# EasyEDA Pro project ProPrj_ESP32 Touchpad.epro, board PCB1
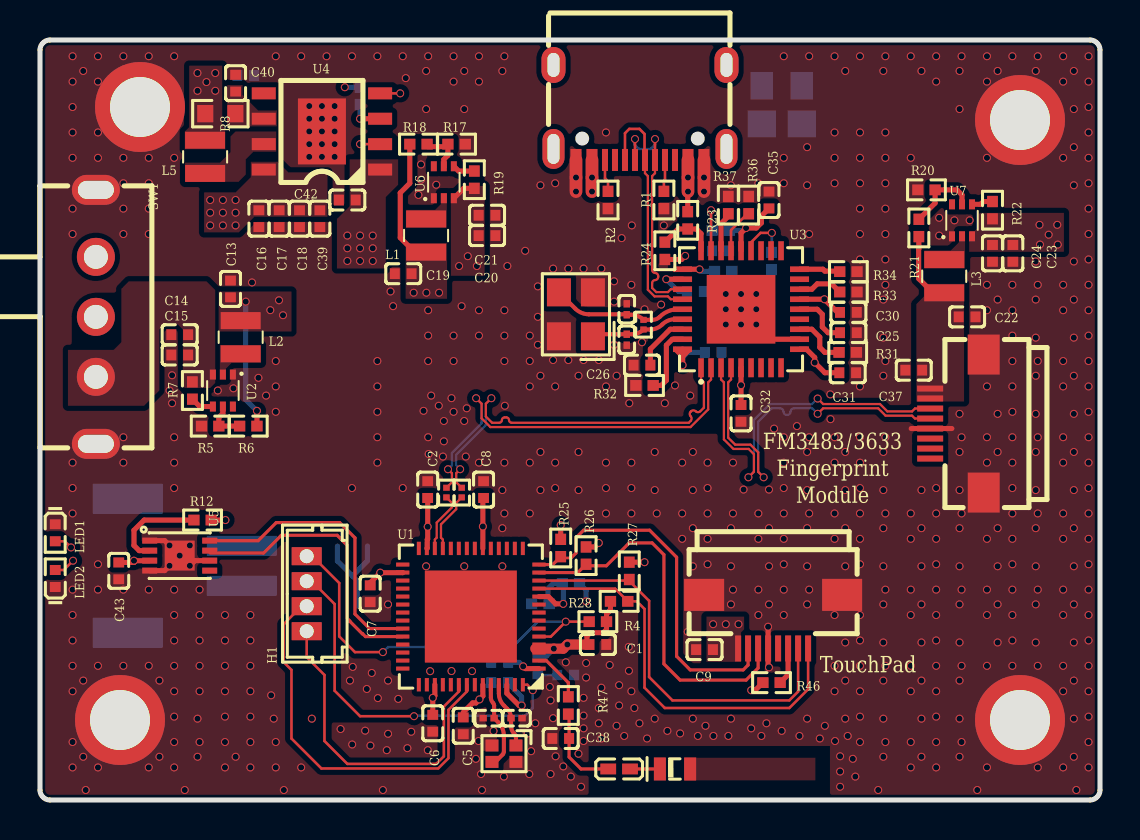
[diagram p5: board, top side]
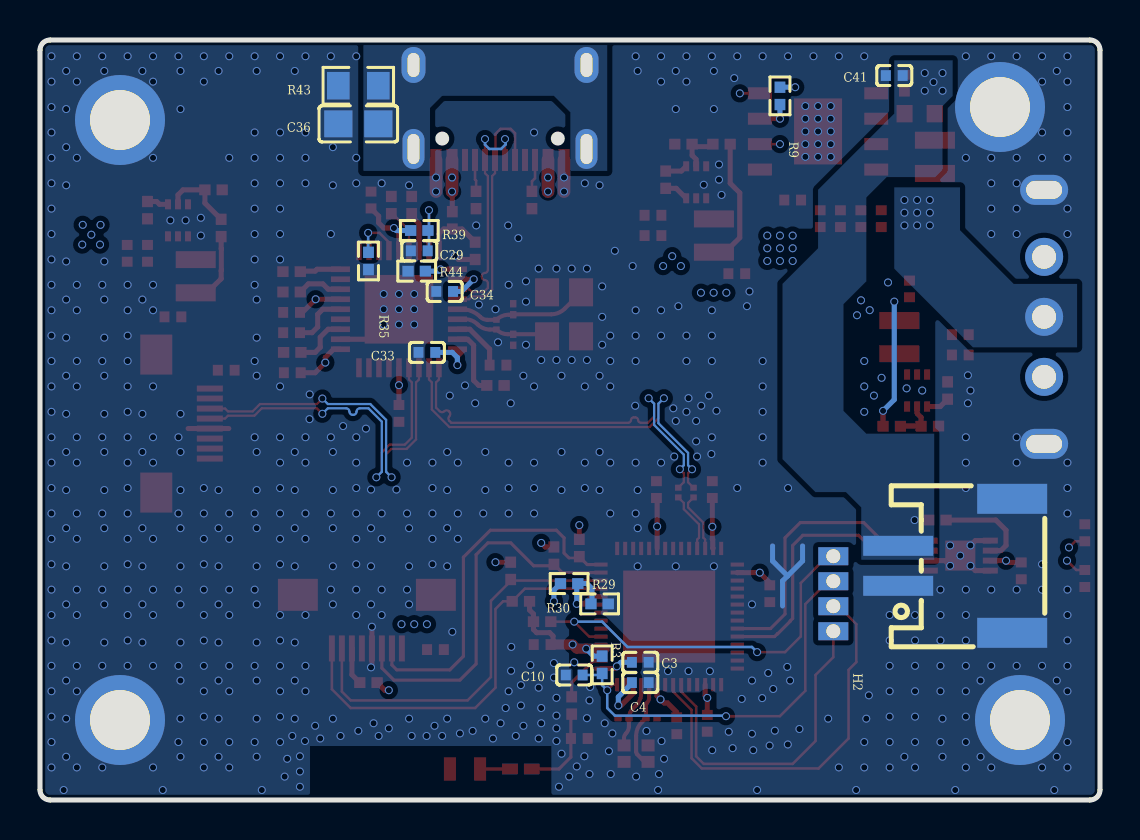
[diagram p6: board, bottom side, seen from below]

Outline 53 x 38 mm; copper layers: Top Layer, Inner1, Inner2, Bottom Layer. Coordinates in mm from the lower left corner of the outline.
Outline path: 0,37.5 0,0.5 arc(0.15,0.15) 0.5,0 52.5,0 arc(52.85,0.15) 53,0.5 53,37.5 arc(52.85,37.85) 52.5,38 0.5,38 arc(0.15,37.85) 0,37.5
Stack: Top Layer 0.035mm Outer layer thickness 1oz / Dielectric1 0.28mm 7628 RC49% 8.6mil / Inner1 0.035mm Inner layer thickness / Dielectric2 0.28mm 1.1mm H/HOZ Copper / Inner2 0.035mm Inner layer thickness / Dielectric3 0.28mm 7628 RC49% 8.6mil / Bottom Layer 0.035mm Outer layer thickness 1oz

## Design rules (mm)
net D-: D
net D+: D
net D1-: D1
net D1+: D1
net D2-: D2
net D2+: D2
net ESP_D_R-: ESP_D_R
net ESP_D_R+: ESP_D_R
spacing copperThickness1oz (default): track to track 0.102, other pairs 0.152 to 0.3
spacing copperThickness2oz: track to track 0.203, other pairs 0.152 to 0.3
track width copperThickness1oz (default): min 0.127, default 0.254, max 2.54
track width copperThickness2oz: min 0.203, default 0.254, max 2.54
differential pair differentialPair (default): width min 0.112, default 0.112, max 2.54; gap min 0.102, default 0.102
net GND uses copperRegion

## Placement (name value [footprint] x y rotation side)
ANT1  KH-1608-H08  [ANT-SMD_L1.7-W0.9]  31.75 1.55 180 top
C1  100nF  [C0402]  27.89 7.77 0 top
C2  100nF  [C0402]  19.38 15.52 90 top
C3  100nF  [C0402]  22.99 6.89 180 bottom
C4  100nF  [C0402]  22.99 5.87 180 bottom
C5  100nF  [C0402]  21.16 3.71 270 top
C6  100nF  [C0402]  19.64 3.84 270 top
C7  100nF  [C0402]  16.51 10.31 270 top
C8  100nF  [C0402]  22.18 15.52 90 top
C9  1uF  [C0402]  33.23 7.52 0 top
C10  1uF  [C0402]  26.29 6.25 180 bottom
C11  12pF  [C0201]  23.83 4.09 0 top
C12  12pF  [C0201]  22.43 4.09 180 top
C13  22uF  [C0402]  9.53 25.55 270 top
C14  100nF  [C0402]  6.98 23.27 0 top
C15  10uF  [C0402]  6.98 22.25 0 top
C16  22uF  [C0402]  10.94 29.07 90 top
C17  22uF  [C0402]  11.96 29.07 90 top
C18  22uF  [C0402]  12.98 29.07 90 top
C19  22uF  [C0402]  18.16 26.32 0 top
C20  100nF  [C0402]  22.35 28.22 180 top
C21  10uF  [C0402]  22.35 29.24 180 top
C22  22uF  [C0402]  46.35 24.16 180 top
C23  100nF  [C0402]  48.64 27.33 90 top
C24  10uF  [C0402]  47.62 27.33 90 top
C25  100nF  [C0402]  40.42 23.37 0 top
C26  100nF  [C0402]  30.1 21.74 0 top
C27  12pF  [C0201]  29.34 23.01 270 top
C28  12pF  [C0201]  29.34 24.54 90 top
C29  100nF  [C0402]  34.04 27.46 180 bottom
C30  100nF  [C0402]  40.42 24.38 0 top
C31  100nF  [C0402]  40.39 21.36 0 top
C32  100nF  [C0402]  35.05 19.33 270 top
C33  100nF  [C0402]  33.66 22.38 0 bottom
C34  100nF  [C0402]  32.77 25.43 0 bottom
C35  100nF  [C0402]  36.45 30 90 top
C36  100nF  [C0805]  37.08 33.81 0 bottom
C37  1uF  [C0402]  43.69 21.49 0 top
C38  1.5pF  [C0402]  26.03 3.08 0 top
C39  22uF  [C0402]  13.99 29.07 90 top
C40  22uF  [C0402]  9.78 35.84 270 top
C41  22uF  [C0402]  10.29 36.22 180 bottom
C42  22uF  [C0402]  15.37 30 180 top
C43  100nF  [C0402]  3.94 11.46 270 top
FPC1  AFC01-S08FCA-00  [FPC-SMD_P0.50-8P_FGS-XJ-H2.0]  36.66 8.92 0 top
FPC2  AFC01-S08FCA-00  [FPC-SMD_P0.50-8P_FGS-XJ-H2.0]  45.85 18.82 270 top
H1  WAFER-MX1.25-4PZZ  [CONN-TH_4P-P1.25_WAFER-MX1.25-4PZZ]  13.34 10.31 90 top
H2  WAFER-PH2.0-2PWB  [CONN-SMD_2P-P2.00_XUNPU_WAFER-PH2.0-2PWB]  7.24 11.71 90 bottom
L1  4.7uH  [IND-SMD_L2.5-W2.0-VLS252012CX-150M]  19.3 28.22 270 top
L2  4.7uH  [IND-SMD_L2.5-W2.0-VLS252012CX-150M]  10.03 23.14 90 top
L3  4.7uH  [IND-SMD_L2.5-W2.0-VLS252012CX-150M]  45.21 26.19 270 top
L4  10nH  [L0402-RD]  28.96 1.55 180 top
L5  1uH  [IND-SMD_L2.5-W2.0-VLS252012CX-150M]  8.25 32.16 90 top
LED1  NCD0402R1  [LED0402-RD]  0.76 13.36 270 top
LED2  NCD0402R1  [LED0402-RD]  0.76 11.08 90 top
NOREF  -  [Pad_e344]  49 34 0 top
NOREF#2  -  [Pad_e342]  5 34.65 0 top
NOREF#3  -  [Pad_e343]  49 4 0 top
NOREF#4  -  [Pad_e341]  4 4 0 top
R1  5.1kΩ  [R0402]  31.19 30 90 top
R2  5.1kΩ  [R0402]  28.4 30 90 top
R3  10kΩ  [R0402]  24.89 6.76 90 bottom
R4  10kΩ  [R0402]  27.89 8.92 0 top
R5  110kΩ  [R0402]  8.51 18.69 0 top
R6  510kΩ  [R0402]  10.41 18.69 0 top
R7  5.1kΩ  [R0402]  7.62 20.47 270 top
R8  500mΩ  [R0603]  9.02 34.32 180 top
R9  5.1kΩ  [R0402]  16 35.21 90 bottom
R10  22Ω  [R0201]  21.08 15.37 270 top
R11  22Ω  [R0201]  20.32 15.37 270 top
R12  470Ω  [R0402]  8.13 14 180 top
R17  110kΩ  [R0402]  20.83 32.79 180 top
R18  510kΩ  [R0402]  18.92 32.79 180 top
R19  5.1kΩ  [R0402]  21.72 31.02 90 top
R20  110kΩ  [R0402]  44.32 30.51 0 top
R21  510kΩ  [R0402]  43.94 28.6 270 top
R22  5.1kΩ  [R0402]  47.62 29.49 90 top
R23  47kΩ  [R0402_1]  32.38 28.98 90 top
R24  100kΩ  [R0402_1]  31.24 27.46 90 top
R25  5.1kΩ  [R0402]  26.03 12.6 270 top
R26  5.1kΩ  [R0402]  27.31 12.22 270 top
R27  5.1kΩ  [R0402]  29.46 11.46 270 top
R28  5.1kΩ  [R0402]  28.96 9.93 0 top
R29  47kΩ  [R0402_1]  26.54 10.82 0 bottom
R30  100kΩ  [R0402_1]  25.02 9.81 0 bottom
R31  5.1kΩ  [R0402]  40.39 22.38 0 top
R32  12kΩ  [R0402]  30.23 20.73 180 top
R33  5.1kΩ  [R0402]  40.42 25.4 0 top
R34  5.1kΩ  [R0402]  40.42 26.42 0 top
R35  5.1kΩ  [R0402]  36.58 26.95 270 bottom
R36  5.1kΩ  [R0402]  35.43 29.75 90 top
R37  5.1kΩ  [R0402]  34.42 29.75 90 top
R39  100kΩ  [R0402_1]  34.04 28.47 0 bottom
R40  1MΩ  [R0201]  30.18 23.77 90 top
R43  1MΩ  [R0805]  37.08 35.71 0 bottom
R44  5.1kΩ  [R0402]  34.16 26.44 0 bottom
R46  10kΩ  [R0402]  36.58 5.87 180 top
R47  0Ω  [R0402_1]  26.42 4.73 90 top
SW1  SK12F14G5  [SW-TH_SK12F14G5]  2.79 24.16 270 top
U1  2.4GHz  [QFN-56_L7.0-W7.0-P0.40-TL-EP4.6]  21.54 9.17 180 top
U2  TPS62A02DRLR  [SOT-563_L1.6-W1.2-P0.50-LS1.6-TL]  9.14 20.47 270 top
U3  USB2513B/M2  [QFN-36_L6.0-W6.0-P0.50-BL-EP3.9]  35.05 24.54 0 top
U4  IP5306  [ESOP-8_L4.9-W3.9-P1.27-LS6.0-BL-EP]  14.1 33.43 90 top
U5  CW2015CHBD  [TDFN-8_L3.0-W2.0-P0.50-BL-EP]  6.98 12.22 270 top
U6  TPS62A02DRLR  [SOT-563_L1.6-W1.2-P0.50-LS1.6-TL]  20.19 30.89 90 top
U7  TPS62A02DRLR  [SOT-563_L1.6-W1.2-P0.50-LS1.6-TL]  46.1 28.98 90 top
USB1  TYPE-C 16PIN 2MD(073)  [USB-C-SMD_TYPE-C-6PIN-2MD-073]  30 34.38 180 top
X1  40MHz  [CRYSTAL-SMD_4P-L1.6-W1.2-BL]  23.2 2.32 180 top
X2  24MHz  [CRYSTAL-SMD_4P-L3.2-W2.5-BL]  26.8 24.28 90 top

## Footprints (pads in the part's own frame, mm; a bottom-side part is the same pattern mirrored in y, then rotated)
ANT-SMD_L1.7-W0.9
  rect 0.6x1.15 smd: 1(-0.756,0) 2(0.756,0)
C0201
  rect 0.368x0.324 smd: 1(-0.275,0) 2(0.275,0)
C0402
  rect 0.5x0.54 smd: 1(-0.42,0) 2(0.42,0)
C0805
  rect 1.41x1.35 smd: 1(-1,0) 2(1,0)
CONN-SMD_2P-P2.00_XUNPU_WAFER-PH2.0-2PWB
  rect 1x3.5 smd: 1(-1,2.85) 2(1,2.85)
  rect 1.5x3.5 smd: 3(-3.35,-2.85) 4(3.35,-2.85)
CONN-TH_4P-P1.25_WAFER-MX1.25-4PZZ
  rect 0.9x1.5 hole 0.7: 1(1.875,0) 2(0.625,0) 3(-0.625,0) 4(-1.875,0)
CRYSTAL-SMD_4P-L1.6-W1.2-BL
  rect 0.65x0.6 smd: 1(-0.6,-0.41) 2(0.6,-0.41) 3(0.6,0.41) 4(-0.6,0.41)
CRYSTAL-SMD_4P-L3.2-W2.5-BL
  rect 1.4x1.2 smd: 1(-1.1,-0.85) 2(1.1,-0.85) 3(1.1,0.85) 4(-1.1,0.85)
ESOP-8_L4.9-W3.9-P1.27-LS6.0-BL-EP
  rect 0.6x1.2 smd: 1(-1.905,-2.909) 2(-0.635,-2.909) 3(0.635,-2.909) 4(1.905,-2.909) 5(1.905,2.909) 6(0.635,2.909) 7(-0.635,2.909) 8(-1.905,2.909)
  rect 3.3x2.4 smd: 9(0,0)
FPC-SMD_P0.50-8P_FGS-XJ-H2.0
  rect 0.3x1.3 smd: 1(-1.75,-1.34) 2(-1.252,-1.339) 3(-0.75,-1.34) 4(-0.25,-1.34) 5(0.25,-1.34) 6(0.75,-1.34) 7(1.25,-1.34) 8(1.75,-1.34)
  rect 2x1.6 smd: 9(3.45,1.34) 10(-3.45,1.34)
IND-SMD_L2.5-W2.0-VLS252012CX-150M
  rect 0.85x2 smd: 1(-0.83,0) 2(0.83,0)
L0402-RD
  rect 0.79x0.54 smd: 1(-0.545,0) 2(0.545,0)
LED0402-RD
  rect 0.5x0.54 smd: 1(-0.425,0) 2(0.425,0)
Pad_e341
  round 4.5 hole 3: 1(0,0)
Pad_e342
  round 4.5 hole 3: 1(0,0)
Pad_e343
  round 4.5 hole 3: 1(0,0)
Pad_e344
  round 4.5 hole 3: 1(0,0)
QFN-36_L6.0-W6.0-P0.50-BL-EP3.9
  rect 0.28x0.95 smd: 1(-2,-2.925) 2(-1.5,-2.925) 3(-1,-2.925) 4(-0.5,-2.925) 5(0,-2.925) 6(0.5,-2.925) 7(1,-2.925) 8(1.5,-2.925) 9(2,-2.925) 19(2,2.925) 20(1.5,2.925) 21(1,2.925) 22(0.5,2.925) 23(0,2.925) 24(-0.5,2.925) 25(-1,2.925) 26(-1.5,2.925) 27(-2,2.925)
  rect 0.95x0.28 smd: 10(2.925,-2) 11(2.925,-1.5) 12(2.925,-1) 13(2.925,-0.5) 14(2.925,0) 15(2.925,0.5) 16(2.925,1) 17(2.925,1.5) 18(2.925,2) 28(-2.925,2) 29(-2.925,1.5) 30(-2.925,1) 31(-2.925,0.5) 32(-2.925,0) 33(-2.925,-0.5) 34(-2.925,-1) 35(-2.925,-1.5) 36(-2.925,-2)
  rect 3.429x3.429 smd: 37(0,0)
QFN-56_L7.0-W7.0-P0.40-TL-EP4.6
  rect 0.665x0.2 smd: 1(-3.408,2.6) 2(-3.408,2.2) 3(-3.408,1.8) 4(-3.408,1.4) 5(-3.408,1) 6(-3.408,0.6) 7(-3.408,0.2) 8(-3.408,-0.2) 9(-3.408,-0.6) 10(-3.408,-1) 11(-3.408,-1.4) 12(-3.408,-1.8) 13(-3.408,-2.2) 14(-3.408,-2.6) 29(3.408,-2.6) 30(3.408,-2.2) 31(3.408,-1.8) 32(3.408,-1.4) 33(3.408,-1) 34(3.408,-0.6) 35(3.408,-0.2) 36(3.408,0.2) 37(3.408,0.6) 38(3.408,1) 39(3.408,1.4) 40(3.408,1.8) 41(3.408,2.2) 42(3.408,2.6)
  rect 0.2x0.665 smd: 15(-2.6,-3.408) 16(-2.2,-3.408) 17(-1.8,-3.408) 18(-1.4,-3.408) 19(-1,-3.408) 20(-0.6,-3.408) 21(-0.2,-3.408) 22(0.2,-3.408) 23(0.6,-3.408) 24(1,-3.408) 25(1.4,-3.408) 26(1.8,-3.408) 27(2.2,-3.408) 28(2.6,-3.408) 43(2.6,3.408) 44(2.2,3.408) 45(1.8,3.408) 46(1.4,3.408) 47(1,3.408) 48(0.6,3.408) 49(0.2,3.408) 50(-0.2,3.408) 51(-0.6,3.408) 52(-1,3.408) 53(-1.4,3.408) 54(-1.8,3.408) 55(-2.2,3.408) 56(-2.6,3.408)
  rect 4.6x4.6 smd: 57(0,0)
R0201
  rect 0.303x0.324 smd: 1(-0.241,0) 2(0.241,0)
R0402
  rect 0.566x0.54 smd: 1(-0.433,0) 2(0.433,0)
R0402_1
  rect 0.566x0.54 smd: 1(-0.433,0) 2(0.433,0)
R0603
  rect 0.806x0.864 smd: 1(-0.753,0) 2(0.753,0)
R0805
  rect 1.133x1.377 smd: 1(-1,0) 2(1,0)
SOT-563_L1.6-W1.2-P0.50-LS1.6-TL
  rect 0.5x0.3 smd: 1(-0.8,0.5) 2(-0.8,0) 3(-0.8,-0.5) 4(0.8,-0.5) 5(0.8,0) 6(0.8,0.5)
SW-TH_SK12F14G5
  round 1.9 hole 1.2: 1(-3,0) 2(0,0) 3(3,0)
  oval 1.5x2.4 hole 0.9x1.8: 4(6.35,0) 5(-6.35,0)
TDFN-8_L3.0-W2.0-P0.50-BL-EP
  rect 0.3x0.75 smd: 1(-0.75,-1.5) 2(-0.249,-1.5) 3(0.25,-1.5) 4(0.75,-1.5) 5(0.75,1.5) 6(0.25,1.5) 7(-0.249,1.5) 8(-0.75,1.5)
  rect 1.5x1.5 smd: 9(-0.001,-0.001)
USB-C-SMD_TYPE-C-6PIN-2MD-073
  rect 0.55x1.1 smd: 1(-3.2,2.375) 2(-2.4,2.375) 11(2.4,2.375) 12(3.2,2.375)
  rect 0.3x1.1 smd: 3(-1.75,2.375) 4(-1.25,2.375) 5(-0.75,2.375) 6(-0.25,2.375) 7(0.25,2.375) 8(0.75,2.375) 9(1.25,2.375) 10(1.75,2.375)
  oval 1.1x2 hole 0.6x1.5: 13(-4.325,1.825) 14(4.325,1.825)
  oval 1.2x1.8 hole 0.6x1.2: 13(-4.325,-2.375) 14(4.325,-2.375)

## Nets
As in the schematic, except:
+3.3V_2513B: C19.1 L1.2 R18.2 R39.2 U3.5 U3.10 U3.15 U3.23 U3.29 U3.36
+3.3V_ESP32: C3.1 C4.1 C7.1 C9.1 C13.2 C43.1 FPC1.1 L2.2 R3.2 R4.2 R6.2 R25.1 R26.1 R27.1 R28.1 R46.2 U1.1 U1.3 U1.4 U1.20 U1.27 U1.30 U1.45 U1.51 U1.54 U5.3
+3.3V_FIG: C22.1 C37.1 FPC2.1 FPC2.2 L3.2 R21.2
+5V: C20.1 C21.1 C23.1 C24.1 C42.1 R19.1 R22.1 R23.2 R29.2 U4.1 U6.3 U7.3 USB1.2 USB1.11
GND: C1.1 C2.1 C3.2 C4.2 C5.1 C6.1 C7.2 C8.1 C10.1 C11.2 C12.2 C13.1 C14.1 C15.1 C16.1 C17.1 C18.1 C25.1 C27.2 C28.2 C30.1 C31.1 C32.1 C33.1 C34.1 C35.1 C36.2 C38.1 C39.1 C40.1 C41.1 C42.2 C43.2 FPC1.4 FPC1.9 FPC1.10 FPC2.5 FPC2.9 FPC2.10 H2.1 H2.3 H2.4 LED1.1 LED2.1 NOREF.1 NOREF#2.1 NOREF#3.1 NOREF#4.1 R1.1 R2.1 R5.1 R17.1 R20.1 R24.1 R30.1 R31.2 R32.2 R33.2 R34.2 R35.2 R36.2 R37.2 R43.2 R44.2 SW1.4 SW1.5 U1.57 U2.1 U3.11 U3.37 U4.9 U5.1 U5.4 U5.6 U5.9 U6.1 U7.1 USB1.1 USB1.12 X1.2 X1.4 X2.2 X2.4
2513B_RST#: C29.1 R39.1 U3.26
$4N122: C26.1 U3.34

Pads without a net: ANT1 1; C1 2; C2 2; C5 2; C6 2; C8 2; C9 2; C19 2; C20 2; C21 2; C22 2; C23 2; C24 2; C25 2; C26 2; C29 2; C30 2; C31 2; C32 2; C33 2; C34 2; C35 2; C37 2; FPC1 5; FPC2 6 7 8; SW1 1; U1 6 7 8 9 15 16 17 18 19 21 22 23 24 28 29 31 32 33 34 35 36 39 40 41 42 43 44 46 47 50 55; U2 6; U3 6 7 8 9 13 17 19 20 21; U4 5; U5 5; U6 6; U7 6; USB1 3 9

## Via types
v1: diameter 0.399, hole 0.305, Top Layer to Bottom Layer, 738 vias

## Routing (per net, layer and track width the routed paths; a pad name or vN(x,y) marks a point on that pad's centre or on a via; arc(x,y) is an arc through that point)
+3.3V_2513B: length 60.2
  Top Layer w0.254: U3.15 v1(39.22,25.04) 39.88,24.38 ; 36.45,29.58 36.07,29.2 36.07,28.86 35.81,28.6 v1(35.3,28.6) 35.05,28.35 U3.23 ; U3.5 v1(35.05,20.74) 35.05,19.88 ; R18.2 18.49,30.84 18.01,30.36 18.01,28.12 18.74,27.39 L1.2 ; 32.13,22.54 32.13,22.53 32.13,22.18 ; U3.10 38.32,22.54 38.74,22.12 v1(38.74,21.87) 39.24,21.36 39.84,21.36 ; 32.44,22.52 32.44,22.49 32.13,22.18 ; 32.13,22.18 31.78,22.53 ; 32.13,22.18 v1(32.13,21.74) ; 32.13,26.04 v1(31.31,26.04)
  Inner2 w0.762: 35.32,28.6 35.81,29.09 39.26,29.09 39.98,28.37 39.98,25.8 v1(39.22,25.04) 38.74,24.56 v1(38.74,21.87) 37.6,20.74 v1(35.05,20.74) 33.13,20.74 v1(32.13,21.74) 32,21.87 32,25.35 v1(31.31,26.04) 30.05,27.3 25.35,27.3 23.6,25.55 20.14,25.55 v1(19.95,25.36) v1(19.32,25.36) v1(18.68,25.36)
  Bottom Layer w0.254: v1(32.13,21.74) 32.13,22.12 32.38,22.38 33.11,22.38 ; R39.2 35.18,28.47 v1(35.3,28.6) ; v1(31.31,26.04) 31.93,25.43 32.22,25.43
+3.3V_ESP32: length 130.5
  Top Layer w0.254: 22.18,14.98 22.14,14.94 v1(22.14,13.68) U1.20 ; U5.3 5.48,11.97 v1(4.7,11.97) 4.7,11.88 C43.1 ; U1.45 19.74,5.21 v1(19.64,5.11) 19.64,4.38 ; U1.1 24.27,6.57 v1(24.16,6.68) ; R46.2 35.76,5.49 v1(35.56,5.49) ; 10.85,18.69 v1(10.85,19.46) ; v1(27.94,12.85) 27.74,12.65 R26.1 ; U1.51 22.14,5.2 v1(21.97,5.03) 21.8,4.85 21.63,4.85 21.16,4.38 ; R27.1 v1(30.23,11.89) ; U1.27 19.36,12.6 19.36,13.03 19.38,13.05 v1(19.38,13.66) 19.38,14.98 ; U1.54 23.34,5.34 23.95,4.73 v1(24.08,4.73) ; U1.30 18.13,11.37 v1(17.01,11.37) 16.51,10.87 C7.1 ; R28.1 28.52,9.5 28.33,9.3 R4.2 28.33,8.53 28.17,8.37 27.52,8.37 27.35,8.2 27.35,7.77 ; R25.1 v1(26.03,13.74)
  Top Layer w0.508: 24.76,7.57 v1(25.69,7.57) 26.16,7.57 v1(26.37,7.77) 27.35,7.77
  Inner2 w0.254: v1(34.93,8.79) 35.56,8.79 35.94,8.41 35.94,5.87 v1(35.56,5.49)
  Inner2 w0.762: v1(21.97,5.03) 22.28,4.73 ; v1(21.97,5.03) 22.58,5.03 ; v1(21.97,5.03) 19.72,5.03 v1(19.64,5.11) 18.54,6.2 18.54,9.68 17.01,11.21 v1(17.01,11.37) 17.01,12.82 ; 22.28,4.73 22.58,5.03 ; 22.28,4.73 23.21,4.73 ; 17.01,14.53 17.01,15.61 18.44,17.04 18.44,21.84 17.4,22.89 13.5,22.89 v1(12.15,24.24) 11.95,24.44 ; 17.01,14.53 17.87,13.68 ; 17.01,14.53 17.01,13.72 ; 17.01,14.53 16.2,13.72 ; 11.95,24.44 11.9,24.49 v1(11.51,24.49) 11.95,24.93 ; 11.95,24.44 11.95,24.93 ; 22.58,5.03 23.2,5.65 ; 30.23,10.77 31.35,10.77 ; 30.23,10.77 27.47,8.01 ; 30.23,10.77 v1(30.23,11.89) 30.79,11.33 ; 30.23,10.77 30.79,11.33 ; 31.35,10.77 33.33,8.79 v1(33.66,8.79) v1(34.29,8.79) v1(34.93,8.79) ; 31.35,10.77 30.79,11.33 ; v1(25.69,7.57) 25.25,8.01 ; 25.25,8.01 26.13,8.01 ; 25.25,8.01 25.25,8.05 24.89,8.41 ; 23.49,5.94 23.49,5.32 v1(24.08,4.73) ; 23.49,5.94 23.2,5.65 ; 23.49,5.94 24.16,6.61 v1(24.16,6.68) ; 23.2,5.65 23.2,4.74 23.21,4.73 ; 27.47,8.01 27.23,7.77 v1(26.37,7.77) ; 27.47,8.01 26.13,8.01 ; 24.89,7.47 24.89,6.69 24.9,6.68 ; 24.89,7.47 24.89,8.41 ; 24.89,7.47 24.16,6.74 v1(24.16,6.68) ; 17.87,13.68 17.01,12.82 ; 17.87,13.68 17.06,13.68 17.01,13.72 ; 17.87,13.68 v1(22.14,13.68) ; 17.01,12.82 17.01,12.91 ; v1(24.16,6.68) 24.9,6.68 ; v1(27.94,12.85) 27.05,13.74 v1(26.03,13.74) 25.53,13.74 24.89,13.11 24.89,8.41 ; v1(26.37,7.77) 25.99,7.77 24.9,6.68 ; v1(26.37,7.77) 26.13,8.01 ; 11.95,24.93 v1(11.95,24.99) ; 23.21,4.73 23.98,4.73 ; 16.2,13.72 11.83,13.72 10.79,14.76 6.42,14.76 4.7,13.04 v1(4.7,11.97) ; 16.2,13.72 17.01,12.91 ; 16.2,13.72 17.01,13.72 ; 17.01,12.91 17.01,13.72
  Bottom Layer w0.254: 23.41,5.87 23.41,5.83 24.08,5.15 v1(24.08,4.73) ; v1(10.29,24.92) 10.29,20.02 v1(10.85,19.46) ; R3.2 25.31,7.19 v1(25.69,7.57) ; 23.41,6.89 23.96,6.89 v1(24.16,6.68)
+3.3V_FIG: length 3.7
  Top Layer w0.254: R21.2 43.94,27.57 43.93,27.56 43.93,26.48 43.94,26.47 43.94,26.06 44.65,25.36 L3.2
+5V: length 33.4
  Top Layer w0.254: R19.1 21.19,30.58 U6.3 ; R23.2 32.38,30.41 v1(32.4,30.42)
  Top Layer w0.635: v1(27.6,30.42) v1(27.6,31.13) USB1.11 ; USB1.2 v1(32.4,31.13) v1(32.4,30.42)
  Inner2 w0.254: 16.64,26.06 16.64,24.51 18.64,22.51 21.72,22.51 24.26,19.97 27.31,19.97 28.96,18.31 28.96,11.58 v1(27.31,9.93) ; 16.64,26.06 16.64,26.44 ; 16.64,26.06 17.01,26.43 ; 16.64,26.06 16.26,26.44
  Bottom Layer w0.254: R29.2 27.31,10.49 v1(27.31,9.93)
  vias: v1(15.37,28.22) v1(15.37,27.59) v1(15.37,26.95) v1(16,28.22) v1(16,27.59) v1(16,26.95) v1(16.64,28.22) v1(16.64,27.59) v1(16.64,26.95) v1(20.96,26.7) v1(21.39,27.19) v1(21.84,26.7) v1(49.97,28.76) v1(50,27.77) v1(50.43,28.27) v1(50.86,28.76) v1(50.89,27.77)
+5V_ESP32:
  vias: v1(8.51,30) v1(8.51,29.36) v1(8.51,28.73) v1(9.14,30) v1(9.14,29.36) v1(9.14,28.73) v1(9.78,30) v1(9.78,29.36) v1(9.78,28.73)
GND: length 20.4
  Top Layer w0.254: U5.1 6.23,12.97 v1(6.48,12.73) ; v1(6.48,11.71) 6.23,11.47 U5.4 ; 43.56,18.57 FPC2.5 45.59,18.57 ; v1(32.26,27.2) 32.08,27.03 R24.1 ; v1(7.49,11.71) 7.75,11.97 U5.6 ; U3.11 36.55,23.04 v1(35.81,23.78) v1(35.05,24.54) ; v1(36.41,8.66) FPC1.4 36.41,6.63
  Top Layer w0.635: USB1.1 v1(33.2,31.13) v1(33.2,30.42) ; v1(26.8,30.42) v1(26.8,31.13) USB1.12
  Bottom Layer w0.254: 16.37,12.7 16.37,11.95 15.62,11.2 ; 15.87,9.7 15.87,10.95 15.62,11.2 ; 15.62,11.2 14.87,11.95 14.87,12.7
  vias: v1(1.63,37.19) v1(1.63,35.92) v1(1.63,34.65) v1(1.63,33.38) v1(1.63,32.11) v1(1.63,29.57) v1(1.63,28.3) v1(1.63,16.87) v1(1.63,15.6) v1(1.63,14.33) v1(1.63,10.52) v1(1.63,9.25) v1(1.63,7.98) v1(1.63,6.71) v1(1.63,5.44) v1(1.63,2.9) v1(1.63,1.63) v1(2.16,36.45) v1(2.16,5.97) v1(2.16,2.16) v1(2.29,0.5) v1(2.9,37.19) v1(2.9,35.92) v1(2.9,33.38) v1(2.9,32.11) v1(2.9,11.79) v1(2.9,10.52) v1(2.9,6.71) v1(2.9,1.63) v1(4.17,37.19) v1(4.17,32.11) v1(4.17,30.84) v1(4.17,29.57) v1(4.17,28.3) v1(4.17,18.14) v1(4.17,16.87) v1(4.17,10.52) v1(4.17,6.71) v1(5.44,37.19) v1(5.44,32.11) v1(5.44,30.84) v1(5.44,29.57) v1(5.44,28.3) v1(5.44,10.52) v1(5.44,6.71) v1(5.44,1.63) v1(5.97,5.97) v1(5.97,2.16) v1(6.48,20.47) v1(6.6,21.24) v1(6.6,19.84) v1(6.71,37.19) v1(6.71,32.11) v1(6.71,18.14) v1(6.71,16.87) v1(6.71,15.6) v1(6.71,10.52) v1(6.71,9.25) v1(6.71,7.98) v1(6.71,6.71) v1(6.71,5.44) v1(6.71,4.17) v1(6.71,2.9) v1(6.71,1.63) v1(6.98,12.22) v1(7.24,0.5) v1(7.49,12.73) v1(7.88,4.07) v1(7.88,2.16) v1(7.98,10.52) v1(7.98,9.25) v1(7.98,7.98) v1(7.98,6.71) v1(7.98,5.44) v1(7.98,2.9) v1(8.89,20.47) v1(9.25,9.25) v1(9.25,7.98) v1(9.25,6.71) v1(9.25,5.44) v1(9.25,4.17) v1(9.25,2.9) v1(9.25,1.63) v1(9.67,20.58) v1(9.78,2.16) v1(10.52,9.25) v1(10.52,7.98) v1(10.52,6.71) v1(10.52,5.44) v1(10.52,4.17) v1(10.52,2.9) v1(10.52,1.63) v1(10.6,25.88) v1(10.92,21.11) v1(11.3,20.22) v1(11.56,5.23) v1(11.69,4.07) v1(11.79,37.19) v1(11.79,21.95) v1(11.79,20.68) v1(11.79,19.41) v1(11.79,2.9) v1(11.79,1.63) v1(12.19,0.5) v1(13.06,37.19) v1(13.06,1.63) v1(13.46,34.7) v1(13.46,34.06) v1(13.46,33.43) v1(13.46,32.79) v1(13.46,32.16) v1(13.59,4.07) v1(14.1,34.7) v1(14.1,34.06) v1(14.1,33.43) v1(14.1,32.79) v1(14.1,32.16) v1(14.33,37.19) v1(14.73,34.7) v1(14.73,34.06) v1(14.73,33.43) v1(14.73,32.79) v1(14.73,32.16) v1(15.03,3.55) v1(15.5,5.97) v1(15.6,37.19) v1(15.6,15.6) v1(15.64,6.65) v1(15.61,2.78) v1(16.34,5.55) v1(16.26,3.47) v1(16.52,2.72) v1(16.59,6.35) v1(16.87,37.19) v1(16.87,21.95) v1(16.87,20.68) v1(16.87,19.41) v1(16.87,18.14) v1(16.87,16.87) v1(16.89,5.09) v1(17.15,0.5) v1(17.34,2.49) v1(17.4,9.78) v1(17.4,5.97) v1(17.4,3.31) v1(17.53,25.43) v1(17.65,24.69) v1(17.91,5.05) v1(18.14,37.19) v1(18.14,15.6) v1(18.29,36.09) v1(18.37,2.59) v1(18.56,3.41) v1(18.92,30.25) v1(19.05,31.78) v1(19.05,31.02) v1(19.18,19.46) v1(19.31,36.45) v1(19.31,34.55) v1(19.31,11.69) v1(19.41,37.19) v1(19.41,24.49) v1(19.41,23.22) v1(19.41,21.95) v1(19.41,18.14) v1(19.43,17.3) v1(19.39,2.49) v1(19.51,6.44) v1(19.56,20.22) v1(19.81,30.76) v1(19.94,19.71) v1(20.15,17.17) v1(20.19,18.95) v1(20.19,17.93) v1(20.57,20.09) v1(20.57,6.45) v1(20.68,37.19) v1(20.68,35.92) v1(20.68,23.22) v1(20.68,21.95) v1(20.68,19.41) v1(21.08,24.69) v1(21.21,36.45) v1(21.21,34.55) v1(21.21,18.95) v1(21.21,11.69) v1(21.34,19.58) v1(21.29,17.17) v1(21.6,6.44) v1(21.8,2.06) v1(21.95,37.19) v1(21.95,35.92) v1(21.95,24.49) v1(21.95,23.22) v1(21.95,16.87) v1(21.92,2.95) v1(22.05,1.3) v1(22.1,0.5) v1(22.68,3.45) v1(23.12,36.45) v1(23.12,15.5) v1(23.12,13.59) v1(23.12,11.69) v1(23.22,37.19) v1(23.22,24.49) v1(23.22,23.22) v1(23.22,21.95) v1(23.24,19.71) v1(23.22,16.87) v1(23.22,14.33) v1(23.19,1.17) v1(23.37,26.7) v1(24.26,27.46) v1(24.38,3.33) v1(24.49,23.22) v1(24.49,21.95) v1(24.49,20.68) v1(24.49,16.87) v1(24.49,14.33) v1(24.46,1.3) v1(24.55,2.44) v1(24.76,3.84) v1(24.89,25.68) v1(24.89,24.16) v1(24.89,22.76) v1(25.02,30.74) v1(25.02,21.21) v1(25.02,17.4) v1(25.02,15.5) v1(25.49,5.65) v1(25.53,4.98) v1(25.53,1.3) v1(25.65,26.57) v1(25.65,22) v1(25.65,4.09) v1(25.76,30.84) v1(25.76,20.68) v1(25.76,16.87) v1(25.76,15.6) v1(25.78,2.19) v1(26.16,1.68) v1(26.29,6.89) v1(26.42,26.57) v1(26.42,22) v1(26.54,1.17) v1(26.93,21.21) v1(26.93,17.4) v1(26.93,15.5) v1(26.92,2.31) v1(27.05,0.66) v1(27.18,26.57) v1(27.18,22) v1(27.18,5.11) v1(27.18,4.22) v1(27.18,3.58) v1(27.18,2.95) v1(27.31,6.85) v1(27.31,6.12) v1(27.94,22) v1(27.94,4.6) v1(27.94,3.84) v1(28.07,26.57) v1(28.07,5.61) v1(28.07,3.08) v1(28.3,33.38) v1(28.3,20.68) v1(28.3,16.87) v1(28.3,15.6) v1(28.3,14.33) v1(28.48,6.75) v1(28.7,25.94) v1(28.7,24.92) v1(28.7,22.76) v1(28.83,21.21) v1(28.83,3.71) v1(28.96,5.74) v1(28.96,4.73) v1(29.08,28.09) v1(29.21,3.2) v1(29.44,7.66) v1(29.45,6.46) v1(29.46,19.84) v1(29.59,28.73) v1(29.57,25.76) v1(29.57,16.87) v1(29.57,15.6) v1(29.57,14.33) v1(29.57,5.44) v1(29.72,4.6) v1(29.97,3.84) v1(30.1,22.89) v1(30.23,24.54) v1(30.35,3.08) v1(30.74,17.4) v1(30.74,15.5) v1(30.74,4.07) v1(30.84,14.33) v1(31.06,24.77) v1(31.19,28.73) v1(31.24,19.84) v1(31.37,3.46) v1(31.75,20.73) v1(32,3.33) v1(32.11,16.87) v1(32.11,14.33) v1(32.11,13.06) v1(32.38,8.41) v1(32.51,20.22) v1(32.64,17.4) v1(32.64,15.5) v1(32.64,13.59) v1(32.64,11.69) v1(32.64,4.07) v1(32.89,3.2) v1(33.27,3.71) v1(33.38,16.87) v1(33.38,15.6) v1(33.38,14.33) v1(33.38,13.06) v1(33.38,11.79) v1(33.67,3.2) v1(34.29,25.3) v1(34.29,24.54) v1(34.29,23.78) v1(34.42,3.2) v1(34.55,30.74) v1(34.55,13.59) v1(34.55,11.69) v1(34.55,9.78) v1(34.55,4.07) v1(34.65,16.87) v1(34.65,14.33) v1(34.65,10.52) v1(35.05,25.3) v1(35.05,23.78) v1(35.18,15.52) v1(35.56,3.58) v1(35.81,25.3) v1(35.81,24.54) v1(35.92,30.84) v1(35.92,14.33) v1(35.92,13.06) v1(35.92,10.52) v1(35.92,9.25) v1(36.07,3.2) v1(36.32,3.84) v1(36.45,15.52) v1(36.45,6.63) v1(36.45,13.59) v1(36.45,11.69) v1(36.45,9.78) v1(36.7,18.57) v1(37.08,3.46) v1(37.19,37.19) v1(37.19,32.11) v1(37.19,30.84) v1(37.19,18.14) v1(37.19,16.87) v1(37.19,15.6) v1(37.19,14.33) v1(37.19,13.06) v1(37.19,11.79) v1(37.19,10.52) v1(37.19,9.25) v1(37.85,18.7) v1(37.97,3.2) v1(38.36,32.64) v1(38.36,30.74) v1(38.36,17.4) v1(38.36,15.5) v1(38.36,13.59) v1(38.36,11.69) v1(38.36,9.78) v1(38.36,4.07) v1(38.46,37.19) v1(38.46,28.3) v1(38.46,18.14) v1(38.46,14.33) v1(38.46,10.52) v1(38.99,3.08) v1(39.24,3.71) v1(39.52,20.28) v1(39.52,19.04) v1(39.73,37.19) v1(39.73,33.38) v1(39.73,32.11) v1(39.73,30.84) v1(39.73,18.14) v1(39.73,16.87) v1(39.73,14.33) v1(39.73,13.06) v1(39.73,9.25) v1(39.73,6.71) v1(39.73,5.44) v1(39.75,2.95) v1(40,2.19) v1(40,1.42) v1(40,0.66) v1(40.26,36.45) v1(40.26,17.4) v1(40.26,15.5) v1(40.26,13.59) v1(40.26,11.69) v1(40.26,7.88) v1(40.26,5.97) v1(40.26,4.07) v1(40.39,3.2) v1(40.64,2.06) v1(40.77,1.17) v1(41,37.19) v1(41,33.38) v1(41,32.11) v1(41,30.84) v1(41,29.57) v1(41,28.3) v1(41,27.03) v1(41,20.68) v1(41,18.14) v1(41,16.87) v1(41,15.6) v1(41,14.33) v1(41,13.06) v1(41,11.79) v1(41,9.25) v1(41,7.98) v1(41,6.71) v1(41,5.44) v1(41,4.17) v1(41,2.9) v1(41.91,0.5) v1(42.17,36.45) v1(42.17,25.02) v1(42.17,23.12) v1(42.17,21.21) v1(42.17,17.4) v1(42.17,15.5) v1(42.17,13.59) v1(42.17,11.69) v1(42.17,9.78) v1(42.17,7.88) v1(42.17,5.97) v1(42.17,4.07) v1(42.17,2.16) v1(42.27,37.19) v1(42.27,33.38) v1(42.27,32.11) v1(42.27,30.84) v1(42.27,29.57) v1(42.27,28.3) v1(42.27,27.03) v1(42.27,25.76) v1(42.27,21.95) v1(42.27,18.14) v1(42.27,14.33) v1(42.27,10.52) v1(42.27,6.71) v1(42.27,2.9) v1(43.54,37.19) v1(43.54,32.11) v1(43.54,14.33) v1(43.54,13.06) v1(43.54,10.52) v1(43.54,9.25) v1(43.54,6.71) v1(43.54,5.44) v1(43.54,2.9) v1(43.54,1.63) v1(44.07,36.45) v1(44.07,15.5) v1(44.07,13.59) v1(44.07,11.69) v1(44.07,9.78) v1(44.07,7.88) v1(44.07,5.97) v1(44.07,4.07) v1(44.07,2.16) v1(44.81,37.19) v1(44.81,35.92) v1(44.81,15.6) v1(44.81,14.33) v1(44.81,13.06) v1(44.81,11.79) v1(44.81,10.52) v1(44.81,9.25) v1(44.81,7.98) v1(44.81,6.71) v1(44.81,5.44) v1(44.81,4.17) v1(44.81,2.9) v1(44.81,1.63) v1(44.96,29.11) v1(44.96,28.22) v1(45.72,28.98) v1(45.98,36.45) v1(45.98,34.55) v1(45.98,19.31) v1(45.98,17.4) v1(45.98,15.5) v1(45.98,13.59) v1(45.98,11.69) v1(45.98,9.78) v1(45.98,7.88) v1(45.98,5.97) v1(45.98,4.07) v1(45.98,2.16) v1(46.08,37.19) v1(46.08,18.14) v1(46.08,14.33) v1(46.08,10.52) v1(46.08,6.71) v1(46.08,2.9) v1(46.48,28.98) v1(46.86,0.5) v1(47.35,37.19) v1(47.35,35.92) v1(47.35,32.11) v1(47.35,25.76) v1(47.35,24.49) v1(47.35,20.68) v1(47.35,18.14) v1(47.35,16.87) v1(47.35,13.06) v1(47.35,10.52) v1(47.35,9.25) v1(47.35,6.71) v1(47.35,1.63) v1(47.88,36.45) v1(47.88,25.02) v1(47.88,19.31) v1(47.88,17.4) v1(47.88,13.59) v1(47.88,11.69) v1(47.88,9.78) v1(47.88,7.88) v1(48.62,37.19) v1(48.62,25.76) v1(48.62,24.49) v1(48.62,23.22) v1(48.62,21.95) v1(48.62,20.68) v1(48.62,19.41) v1(48.62,18.14) v1(48.62,16.87) v1(48.62,15.6) v1(48.62,14.33) v1(48.62,13.06) v1(48.62,11.79) v1(48.62,10.52) v1(48.62,9.25) v1(48.62,7.98) v1(48.62,6.71) v1(49.79,36.45) v1(49.79,26.93) v1(49.79,25.02) v1(49.79,23.12) v1(49.79,21.21) v1(49.79,19.31) v1(49.79,17.4) v1(49.79,15.5) v1(49.79,13.59) v1(49.79,11.69) v1(49.79,9.78) v1(49.79,7.88) v1(49.89,37.19) v1(49.89,25.76) v1(49.89,21.95) v1(49.89,18.14) v1(49.89,14.33) v1(49.89,10.52) v1(49.89,6.71) v1(49.89,1.63) v1(51.16,37.19) v1(51.16,35.92) v1(51.16,32.11) v1(51.16,25.76) v1(51.16,24.49) v1(51.16,21.95) v1(51.16,20.68) v1(51.16,18.14) v1(51.16,16.87) v1(51.16,14.33) v1(51.16,13.06) v1(51.16,10.52) v1(51.16,9.25) v1(51.16,6.71) v1(51.16,5.44) v1(51.16,1.63) v1(51.69,36.45) v1(51.69,34.55) v1(51.69,32.64) v1(51.69,30.74) v1(51.69,26.93) v1(51.69,25.02) v1(51.69,23.12) v1(51.69,21.21) v1(51.69,19.31) v1(51.69,17.4) v1(51.69,15.5) v1(51.69,13.59) v1(51.69,11.69) v1(51.69,9.78) v1(51.69,7.88) v1(51.69,5.97) v1(51.69,4.07) v1(51.69,2.16) v1(51.82,0.5) v1(52.43,37.19) v1(52.43,35.92) v1(52.43,34.65) v1(52.43,33.38) v1(52.43,32.11) v1(52.43,30.84) v1(52.43,29.57) v1(52.43,28.3) v1(52.43,27.03) v1(52.43,25.76) v1(52.43,24.49) v1(52.43,23.22) v1(52.43,21.95) v1(52.43,20.68) v1(52.43,19.41) v1(52.43,18.14) v1(52.43,16.87) v1(52.43,15.6) v1(52.43,14.33) v1(52.43,13.06) v1(52.43,11.79) v1(52.43,10.52) v1(52.43,9.25) v1(52.43,7.98) v1(52.43,6.71) v1(52.43,5.44) v1(52.43,4.17) v1(52.43,2.9) v1(52.43,1.63)
VBAT: length 8.2
  Top Layer w0.254: R12.1 v1(9.27,14)
  Inner2 w0.254: v1(15.24,35.64) 11.12,35.64 10.41,36.35 v1(8.76,36.35)
  Bottom Layer w0.254: R9.2 v1(15.24,35.64)
  vias: v1(7.87,36.35) v1(7.87,35.46) v1(8.32,35.9) v1(8.76,35.46)
2513B_FB: length 2.1
  Top Layer w0.254: U6.5 20.19,32.03 20.4,32.23 20.4,32.67 19.36,32.67
2513B_RST#: length 4.1
  Top Layer w0.127: U3.26 v1(33.55,29.49)
  Bottom Layer w0.127: 33.49,27.46 33.55,27.52 v1(33.55,29.49)
2513B_SCL: length 2.3
  Top Layer w0.127: U3.24 34.55,28.5 35.37,29.31 R36.1
2513B_SDA: length 2.6
  Top Layer w0.127: U3.22 35.55,27.88 36.03,28.36 v1(36.59,28.36)
  Bottom Layer w0.127: v1(36.59,28.36) 36.59,27.4 R35.1
2513B_VBUSDET: length 3
  Top Layer w0.254: U3.27 33.05,28.32 32.82,28.55 R23.1 31.9,28.55 R24.2
2513B_XI: length 4.7
  Top Layer w0.203: 32.13,24.04 31.75,24.04 arc(31.4,23.97) 31.12,23.78 arc(30.84,23.59) 30.51,23.52 R40.1 arc(29.91,23.35) 29.61,23.29 C27.1 27.9,23.29 arc(27.76,23.26) X2.1
2513B_XO: length 6.8
  Top Layer w0.203: X2.3 26.77,24.57 arc(27.08,24.36) 27.45,24.28 29.29,24.28 arc(29.31,24.28) C28.1 29.56,24.26 arc(29.89,24.2) R40.2 30.63,24.01 arc(30.82,24.05) 30.99,24.16 arc(31.41,24.44) 31.91,24.54 32.13,24.54
CW2015_SCL: length 14.2
  Top Layer w0.158: 8.51,12.35 11.18,12.35 12.06,13.23 14.86,13.23 15.37,12.73 15.37,9.08 15.49,8.95 15.49,8.94 16.11,8.31 16.13,8.31 16.27,8.17 U1.38
CW2015_SDA: length 14.5
  Top Layer w0.158: U5.8 10.91,12.97 11.81,13.87 14.99,13.87 15.75,13.11 15.75,9.3 16.47,8.57 U1.37
D1+: length 20.6
  Top Layer w0.112: v1(21.81,20.09) 22.08,19.81 22.08,19.08 22.52,18.65 32.53,18.65 33.41,19.53 33.41,20.88 33.55,21.03 U3.2 ; R11.1 20.6,15.89 20.6,16.34 v1(20.4,16.54)
  Bottom Layer w0.112: v1(20.4,16.54) 20.6,16.73 20.6,17.36 22.08,18.84 22.08,19.81 v1(21.81,20.09)
D1-: length 20.6
  Top Layer w0.112: R10.1 20.81,15.89 20.81,16.34 v1(21.01,16.54) ; U3.1 33.05,21.03 33.2,20.88 33.2,19.62 33.01,19.44 arc(32.9,19.39) 32.78,19.44 arc(32.67,19.48) 32.55,19.44 32.53,19.42 arc(32.48,19.3) 32.53,19.19 arc(32.58,19.07) 32.53,18.95 32.44,18.86 23.59,18.86 arc(23.49,18.9) 23.45,19 arc(23.41,19.09) 23.32,19.13 23.23,19.13 arc(23.13,19.09) 23.09,19 arc(23.06,18.9) 22.96,18.86 22.61,18.86 22.29,19.17 22.29,19.81 v1(22.57,20.09)
  Bottom Layer w0.112: v1(21.01,16.54) 20.81,16.74 20.81,17.27 22.29,18.75 22.29,19.81 v1(22.57,20.09)
D2+: length 19.3
  Top Layer w0.112: v1(38.88,19.31) 39.16,19.58 41.91,19.58 42.28,19.22 43.6,19.22 43.75,19.07 FPC2.4 ; v1(36.18,16.14) 35.91,16.41 35.91,17.38 35.52,17.77 34.76,17.77 34.41,18.12 34.41,20.88 34.55,21.03 U3.4
  Bottom Layer w0.112: v1(36.18,16.14) 35.91,16.41 35.91,18.92 36.58,19.58 37.01,19.58 arc(37.13,19.54) 37.17,19.42 arc(37.22,19.3) 37.34,19.25 37.36,19.25 arc(37.48,19.3) 37.53,19.42 arc(37.58,19.54) 37.69,19.58 38.61,19.58 v1(38.88,19.31)
D2-: length 19.3
  Top Layer w0.112: U3.3 34.05,21.03 34.2,20.88 34.2,18.03 34.67,17.55 35.43,17.55 35.7,17.29 35.7,16.41 v1(35.42,16.14) ; FPC2.3 43.75,19.57 43.6,19.43 42.37,19.43 42,19.8 39.16,19.8 v1(38.88,20.07)
  Bottom Layer w0.112: v1(38.88,20.07) 38.61,19.8 36.49,19.8 35.7,19.01 35.7,16.41 v1(35.42,16.14)
D+: length 12.3
  Top Layer w0.112: 32.13,25.04 31.54,25.04 31.4,25.18 30.73,25.18 30.39,25.51 30.39,31.2 30.25,31.34 USB1.6
  Top Layer w0.127: USB1.8 29.25,33.34 29.46,33.56 29.97,33.56 30.23,33.3 30.23,32.03 USB1.6
D-: length 12.3
  Top Layer w0.112: USB1.5 30.75,31.34 30.61,31.2 30.61,26.5 arc(30.65,26.4) 30.76,26.35 arc(30.86,26.31) 30.91,26.2 30.91,26.15 arc(30.86,26.04) 30.76,26 arc(30.65,25.95) 30.61,25.85 30.61,25.6 30.81,25.39 31.4,25.39 31.54,25.54 32.13,25.54
  Top Layer w0.127: USB1.7 v1(29.75,33.05) ; USB1.5 v1(30.75,33.05)
  Bottom Layer w0.127: v1(30.75,33.05) 30.75,32.77 30.54,32.55 29.95,32.55 29.72,32.78 29.72,33.02 v1(29.75,33.05)
EN: length 20.3
  Top Layer w0.127: U1.56 24.36,5.76 v1(24.64,5.49) ; H1.2 13.34,10.95 13.58,10.95 14.73,9.8 14.73,5.46 16,4.19 v1(18.7,4.19)
  Bottom Layer w0.127: C10.2 24.97,6.25 R3.1 24.89,5.74 v1(24.64,5.49) 24.64,4.6 24.26,4.22 18.73,4.22 v1(18.7,4.19)
ESP32_FB: length 2.1
  Top Layer w0.254: R6.1 R5.2 8.94,19.13 9.14,19.33 U2.5
ESP32_VBUSDET: length 4
  Top Layer w0.254: U1.10 25.42,10.17 25.78,9.81 v1(26.16,9.81)
  Bottom Layer w0.254: R30.2 25.4,9.86 25.4,10.57 25.65,10.82 R29.1 26.16,10.77 v1(26.16,9.81)
ESP32_XI: length 3.3
  Top Layer w0.203: U1.53 22.94,5.33 arc(23.01,5) 23.19,4.73 23.36,4.56 arc(23.5,4.34) C11.1 23.55,3.68 arc(23.59,3.49) 23.7,3.33 arc(23.77,3.22) 23.8,3.09 X1.1
ESP32_XO: length 4.4
  Top Layer w0.203: U1.52 22.54,5.13 arc(22.57,4.98) 22.66,4.85 arc(22.69,4.8) 22.71,4.73 C12.1 22.91,3.89 arc(23.12,3.57) 23.19,3.2 23.19,2.41 arc(23.18,2.34) 23.14,2.28 22.88,2.02 arc(22.75,1.94) X1.3
ESP_D_R+: length 3
  Top Layer w0.112: R11.2 20.6,14.86 20.6,14.63 19.84,13.87 19.84,13.12 19.74,13.02 U1.26
ESP_D_R-: length 3
  Top Layer w0.112: U1.25 20.14,13.02 20.05,13.12 20.05,13.78 20.81,14.54 20.81,14.86 R10.2
FIG_EN: length 1.1
  Top Layer w0.254: U7.4 47.03,29.78 47.17,29.92 R22.2
FIG_FB: length 3.7
  Top Layer w0.254: U7.5 46.1,30.25 45.85,30.51 R20.2 44.76,29.85 R21.1
GPIO0: length 20
  Top Layer w0.127: v1(17.15,7.39) 15.75,7.39 14.96,8.18 14.96,10.85 13.62,12.19 H1.1 ; U1.5 25.54,8.17 v1(26.29,8.92) R4.1
  Bottom Layer w0.127: v1(26.29,8.92) 24.89,8.92 23.63,7.65 17.4,7.65 v1(17.15,7.39)
INT: length 20
  Top Layer w0.127: U1.12 29.44,10.97 30.46,9.96 30.46,6.15 31.62,4.98 37.47,4.98 37.91,5.42 FPC1.7
LED1: length 31.7
  Top Layer w0.127: LED1.2 1.24,12.94 v1(1.55,12.63) ; U4.2 v1(16,32.79)
  Inner2 w0.127: v1(16,32.79) 16,31.02 15.62,30.63 12.32,30.63 11.18,29.49 11.18,28.22 10.29,27.33 7.37,27.33 4.95,24.92 4.95,16.79 3.05,14.89 3.05,14.12 v1(1.55,12.63)
LED2: length 36
  Top Layer w0.127: LED2.2 1.19,11.5 v1(1.65,11.97) ; U4.4 v1(18.01,35.33)
  Inner2 w0.127: v1(1.65,11.97) 3.3,13.62 3.3,14.78 5.21,16.69 5.21,24.81 7.47,27.08 10.39,27.08 11.43,28.12 11.43,29.39 12.42,30.38 15.88,30.38 17.02,31.52 17.02,34.34 v1(18.01,35.33)
LNA_IN: length 2.6
  Top Layer w0.158: R47.2 26.42,5.87 25.31,6.97 U1.2
RX: length 20.1
  Top Layer w0.127: U1.49 21.34,5.43 20.42,4.51 20.42,2.09 19.91,1.58 14.07,1.58 12.57,3.08 12.57,6.5 12.18,6.89 12.18,8.79 13.08,9.69 H1.3
TP_CLK: length 18.4
  Top Layer w0.127: 26.03,12.17 26.1,12.1 26.55,12.1
  Top Layer w0.158: FPC1.2 35.4,6.75 35.16,6.5 32.51,6.5 31.83,7.19 31.83,12.14 30.48,13.49 27.18,13.49 26.8,13.11 26.8,12.35 26.55,12.1 ; 26.03,12.17 25.64,11.77 U1.14
TP_DAT: length 18.9
  Top Layer w0.158: U1.13 26.89,11.37 R26.2 27.38,11.71 28.32,11.71 29.46,12.85 30.61,12.85 31.19,12.27 31.19,6.81 32,6 35.31,6 35.91,6.6 FPC1.3
TP_ON: length 20.7
  Top Layer w0.127: FPC1.8 38.41,5.54 37.47,4.6 31.24,4.6 30.23,5.61 30.23,9.55 29.84,9.93 R28.2 28.75,10.57 24.95,10.57 U1.11
TX: length 16.3
  Top Layer w0.127: H1.4 13.34,7.14 14.22,6.25 14.22,2.95 15.37,1.81 19.81,1.81 20.19,2.19 20.19,4.68 20.94,5.43 U1.48
$1N84: length 1.2
  Top Layer w0.254: R7.2 7.99,19.67 U2.4
$1N120: length 1.9
  Top Layer w0.254: FPC1.6 37.41,6.27 R46.1
$1N124: length 4.4
  Top Layer w0.158: L4.2 27.05,1.55 26.46,2.15 26.46,4.25 R47.1
$1N125: length 1.5
  Top Layer w0.158: L4.1 ANT1.2
$4N3: length 1.6
  Top Layer w0.127: R2.2 28.4,30.94 28.25,31.09 USB1.10
$4N4: length 1.7
  Top Layer w0.127: 31.25,32.13 31.25,31.02 31.19,30.97 R1.2
$4N71: length 1.1
  Top Layer w0.254: U6.4 20.93,31.45 R19.2
$4N99: length 2.8
  Top Layer w0.254: U3.12 38.59,23.54 38.99,23.14 38.99,22.63 39.24,22.38 R31.1
$4N101: length 3.5
  Top Layer w0.254: R32.1 31.06,20.73 31.32,20.98 31.32,22.74 31.62,23.04 32.13,23.04
$4N105: length 2.8
  Top Layer w0.254: U3.14 38.86,24.54 39.12,24.28 39.12,23.65 39.4,23.37 39.87,23.37
$4N109: length 2.1
  Top Layer w0.254: R34.1 39.96,26.44 39.24,26.44 39.15,26.54 U3.18
$4N119: length 1.9
  Top Layer w0.254: 34.42,29.19 34.05,28.82 U3.25
$4N122: length 2.8
  Top Layer w0.254: 30.52,21.74 30.52,22.55 31.51,23.54 32.13,23.54
$4N124: length 2.3
  Top Layer w0.254: R33.1 39.58,25.81 38.86,25.81 38.59,25.54 U3.16
$4N152: length 1.5
  Top Layer w0.254: 32.13,26.54 32.97,26.54 v1(32.98,26.53)
  Bottom Layer w0.254: v1(32.98,26.53) 33.06,26.44 33.6,26.44
$5N19: length 1.7
  Top Layer w0.254: U4.3 v1(16,34.06)
  Bottom Layer w0.254: v1(16,34.06) R9.1
$5N41: length 4.9
  Top Layer w0.254: 7.69,14 5.21,14 4.7,13.49 4.7,12.73 4.96,12.47 U5.2

## Copper pours and planes (outline as drawn; the poured copper is in the pictures)
+3.3V_2513B on Top Layer: 18.28,27.84 20.35,27.84 20.35,25.06 18.28,25.06
+3.3V_ESP32 on Top Layer: 33.32,9.17 35.2,9.17 35.2,6.91 33.32,6.91
+3.3V_ESP32 on Top Layer: 8.93,25.43 12.57,25.43 12.57,23.43 8.93,23.43
+3.3V_FIG on Top Layer: 43.81,25.81 46.2,25.81 46.2,19.93 43.81,19.93
+5V on Top Layer: 20.54,30.7 22.24,30.7 22.24,26.21 20.54,26.21
+5V on Top Layer: 46.46,29.36 51.19,29.36 51.19,27.4 46.46,27.4
+5V on Top Layer: 14.85,32.03 17.91,32.03 17.91,26.58 14.85,26.58
+5V on Inner2: 14.85,35.66 51.56,35.66 51.56,26.32 14.85,26.32
+5V_ESP32 on Top Layer: 8.2,31.91 14.38,31.91 14.38,28.39 8.2,28.39
+5V_ESP32 on Bottom Layer: 1.14,30.63 10.29,30.63 10.29,22.63 1.14,22.63
+5V_ESP32_OUT on Top Layer: 1.4,25.94 8.76,25.94 8.76,19.71 1.4,19.71
DGND on Bottom Layer: 24.64,37.75 36.83,37.75 36.83,31.45 24.64,31.45
GND on Top Layer: 0,38 53.21,38 53.21,-0.1 0,-0.1
GND on Bottom Layer: 0,38 53.21,38 53.21,-0.1 0,-0.1
GND on Inner1: 12.33,12.9 14.34,12.9 14.34,7.73 12.33,7.73
GND on Inner1: 0.26,37.74 52.74,37.74 52.74,0.26 0.26,0.26
GND on Inner1: 8.05,30.45 10.13,30.45 10.13,28.38 8.05,28.38
GND on Inner1: 7.55,36.67 9.09,36.67 9.09,35.14 7.55,35.14
GND on Inner1: 24.87,33 32.69,33 32.69,29.97 24.87,29.97
GND on Inner1: 18.23,25.71 20.41,25.71 20.41,25.02 18.23,25.02
GND on Inner1: 19.94,16.88 21.46,16.88 21.46,16.2 19.94,16.2
GND on Inner1: 27.43,2.7 39.5,2.7 39.5,0.28 27.43,0.28
GND on Inner1: 11.07,25.42 12.48,25.42 12.48,23.92 11.07,23.92
GND on Inner1: 33.2,9.14 35.38,9.14 35.38,8.44 33.2,8.44
GND on Inner1: 15.02,28.57 16.98,28.57 16.98,26.6 15.02,26.6
GND on Inner1: 25.25,10.26 26.81,10.26 26.81,7.35 25.25,7.35
GND on Inner1: 49.62,29.05 51.25,29.05 51.25,27.48 49.62,27.48
GND on Inner1: 20.6,27.65 22.2,27.65 22.2,26.41 20.6,26.41
GND on Inner2: 0,38 53.21,38 53.21,-0.1 0,-0.1
VBAT on Top Layer: 7.24,36.72 9.25,36.72 9.25,32.54 7.24,32.54
VBAT on Bottom Layer: 7.37,36.98 15.88,36.98 15.88,12.01 7.37,12.01
VBAT_R on Top Layer: 9.36,35.75 11.84,35.75 11.84,33.68 9.36,33.68
(no net) on Top Layer: 32.21,2.11 38.77,2.11 38.77,0.98 32.21,0.98
2513B_SW on Top Layer: 18.29,30.34 20.34,30.34 20.34,28.61 18.29,28.61
5306_SW on Top Layer: 7.25,33.43 11.81,33.43 11.81,30.91 7.25,30.91
ESP32_SW on Top Layer: 8.99,22.75 11.05,22.75 11.05,21.02 8.99,21.02
FIG_SW on Top Layer: 44.21,28.44 46.25,28.44 46.25,26.58 44.21,26.58

Small or netless copper shapes (teardrops, artwork), in the pictures only: 37 on Inner1

## Text on the board
Top Silkscreen Layer: TouchPad | FM3483/3633 / Fingerprint / Module
